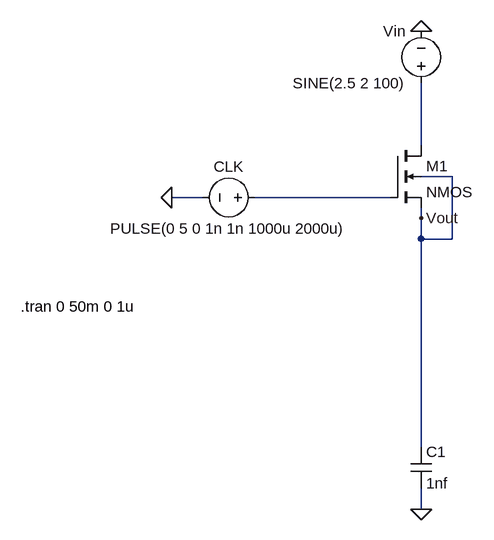
[diagram p0: schematic snh.asc]
snh.asc, the LTspice schematic file:
Version 4
SHEET 1 880 692
WIRE 96 112 96 16
WIRE 144 160 96 160
WIRE -240 192 -288 192
WIRE 48 192 -160 192
WIRE 96 224 96 208
WIRE 96 256 96 224
WIRE 144 256 144 160
WIRE 144 256 96 256
WIRE 96 576 96 256
WIRE 96 672 96 640
FLAG -288 192 0
FLAG 96 -64 0
FLAG 96 672 0
FLAG 96 224 Vout
SYMBOL nmos4 48 112 R0
SYMATTR InstName M1
SYMBOL voltage -144 192 R90
WINDOW 0 -32 56 VBottom 2
WINDOW 3 32 56 VTop 2
WINDOW 123 0 0 Left 0
WINDOW 39 0 0 Left 0
SYMATTR InstName CLK
SYMATTR Value PULSE(0 5 0 1n 1n 1000u 2000u)
SYMBOL voltage 96 32 R180
WINDOW 0 24 96 Left 2
WINDOW 3 24 16 Left 2
SYMATTR InstName Vin
SYMATTR Value SINE(2.5 2 100)
SYMBOL cap 80 576 R0
SYMATTR InstName C1
SYMATTR Value 1nf
TEXT -520 360 Left 2 !.tran 0 50m 0 1u

The netlist it stands for:
* snh.asc
M1 N001 N002 Vout Vout NMOS
V§CLK N002 0 PULSE(0 5 0 1n 1n 1000u 2000u)
Vin N001 0 SINE(2.5 2 100)
C1 Vout 0 1nf
.model NMOS NMOS
.model PMOS PMOS
.lib standard.mos
.tran 0 50m 0 1u
.backanno
.end